# EAGLE design RN-131-Carrier-Board (EAGLE 5.11)
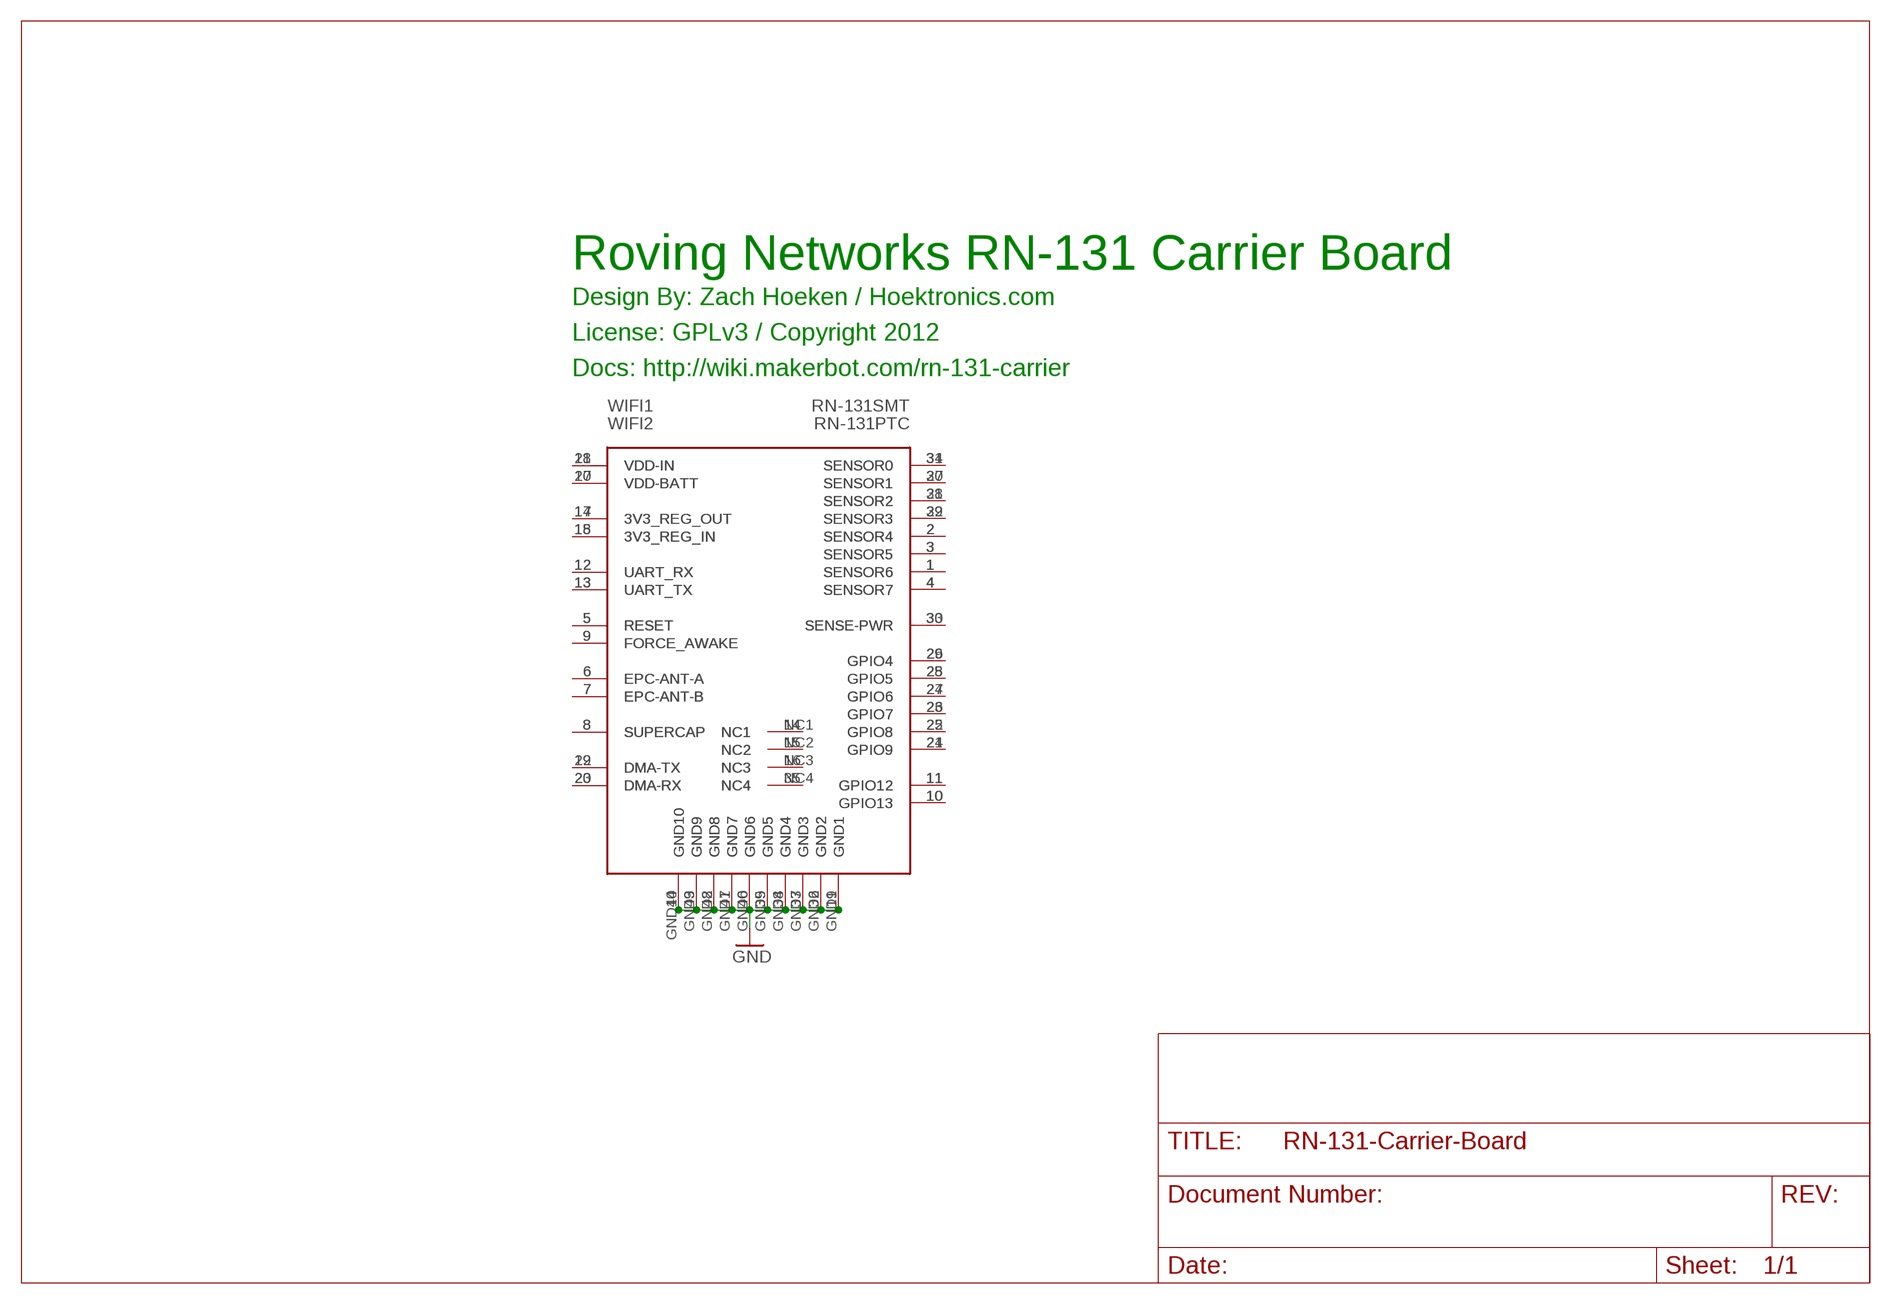
[diagram p0: schematic, sheet 1]

## Parts
WIFI1  RN-131PTC  [RN-131-CARRIER]
WIFI2  RN-131SMT  [RN-131]

## Nets
GND: WIFI1.GND1 WIFI1.GND2 WIFI1.GND3 WIFI1.GND4 WIFI1.GND5 WIFI1.GND6 WIFI1.GND7 WIFI1.GND8 WIFI1.GND9 WIFI1.GND10 WIFI2.19(GND1) WIFI2.36(GND2) WIFI2.37(GND3) WIFI2.38(GND4) WIFI2.39(GND5) WIFI2.40(GND6) WIFI2.41(GND7) WIFI2.42(GND8) WIFI2.43(GND9) WIFI2.44(GND10)
N$1: WIFI1.31(SENSOR0) WIFI2.34(SENSOR0)
N$2: WIFI1.27(SENSOR1) WIFI2.30(SENSOR1)
N$3: WIFI1.28(SENSOR2) WIFI2.31(SENSOR2)
N$4: WIFI1.29(SENSOR3) WIFI2.32(SENSOR3)
N$5: WIFI1.2(SENSOR4) WIFI2.2(SENSOR4)
N$6: WIFI1.3(SENSOR5) WIFI2.3(SENSOR5)
N$7: WIFI1.1(SENSOR6) WIFI2.1(SENSOR6)
N$8: WIFI1.4(SENSOR7) WIFI2.4(SENSOR7)
N$9: WIFI1.5(RESET) WIFI2.5(RESET)
N$10: WIFI1.6(EPC-ANT-A) WIFI2.6(EPC-ANT-A)
N$11: WIFI1.7(EPC-ANT-B) WIFI2.7(EPC-ANT-B)
N$12: WIFI1.8(SUPERCAP) WIFI2.8(SUPERCAP)
N$13: WIFI1.9(FORCE_AWAKE) WIFI2.9(FORCE_AWAKE)
N$14: WIFI1.10(GPIO13) WIFI2.10(GPIO13)
N$15: WIFI1.11(GPIO12) WIFI2.11(GPIO12)
N$16: WIFI1.12(UART_RX) WIFI2.12(UART_RX)
N$17: WIFI1.13(UART_TX) WIFI2.13(UART_TX)
N$18: WIFI1.NC1 WIFI2.14(NC1)
N$19: WIFI1.NC2 WIFI2.15(NC2)
N$20: WIFI1.NC3 WIFI2.16(NC3)
N$21: WIFI1.14(3V3_REG_OUT) WIFI2.17(3V3_REG_OUT)
N$22: WIFI1.15(3V3_REG_IN) WIFI2.18(3V3_REG_IN)
N$24: WIFI1.17(VDD-BATT) WIFI2.20(VDD-BATT)
N$25: WIFI1.18(VDD-IN) WIFI2.21(VDD-IN)
N$26: WIFI1.19(DMA-TX) WIFI2.22(DMA-TX)
N$27: WIFI1.20(DMA-RX) WIFI2.23(DMA-RX)
N$28: WIFI1.21(GPIO9) WIFI2.24(GPIO9)
N$29: WIFI1.22(GPIO8) WIFI2.25(GPIO8)
N$30: WIFI1.23(GPIO7) WIFI2.26(GPIO7)
N$31: WIFI1.24(GPIO6) WIFI2.27(GPIO6)
N$32: WIFI1.25(GPIO5) WIFI2.28(GPIO5)
N$33: WIFI1.26(GPIO4) WIFI2.29(GPIO4)
N$34: WIFI1.NC4 WIFI2.35(NC4)
N$44: WIFI1.30(SENSE-PWR) WIFI2.33(SENSE-PWR)

## Notes on the sheet
- Roving Networks RN-131 Carrier Board
- Design By: Zach Hoeken / Hoektronics.com
- License: GPLv3 / Copyright 2012
- Docs: http://wiki.makerbot.com/rn-131-carrier

## Library data of the parts
WIFI1 WIFI2 = Hoektronics:RN-131

## Board
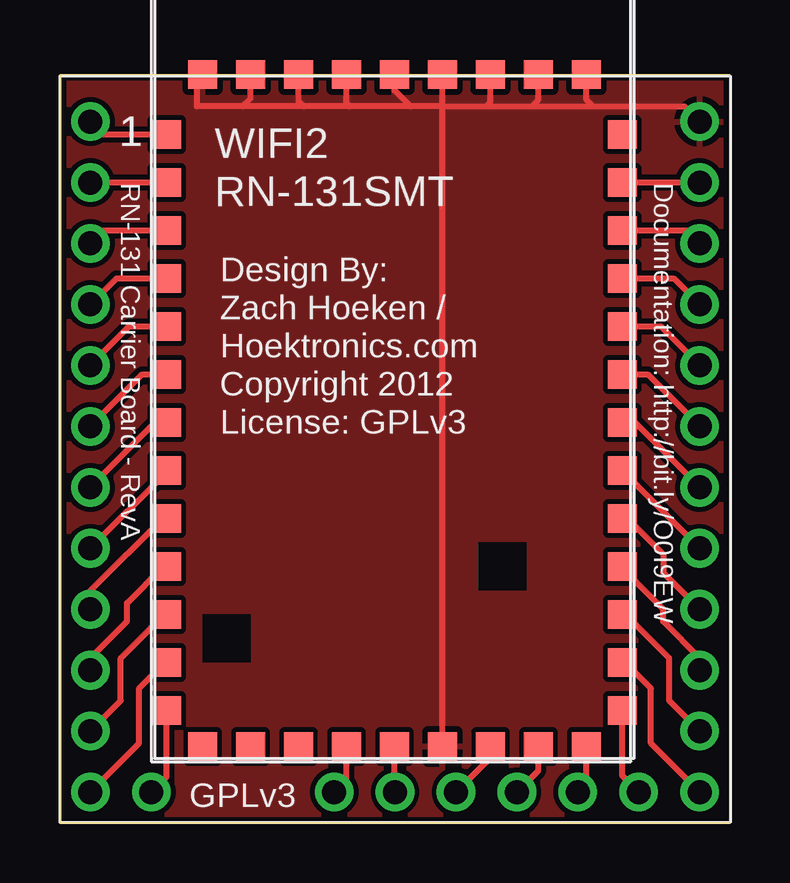
[diagram p1: board, top side]

Size 27.92 x 31.17 mm. Coordinates in mm from the lower left corner, seen from the top.
Outline: 0,0 27.92,0 27.92,31.17 0,31.17 0,0
Copper layers (1*16): Top 0.035mm / dielectric 1.5mm / Bottom 0.035mm
Design rules "hoektronics": minimum track width 8mil, minimum drill 20mil, track to track 8mil, track to pad 8mil, pad to pad 8mil, via to via 8mil, smd to smd 8mil, copper to edge 10mil, drill to drill 8mil, minimum pad ring 12mil, minimum via ring 10mil, stop-mask expansion 4mil, vias tented up to drill 25mil, thermal gap 10mil

### Footprints (pad centres in the part's own frame; a part is rotated, then mirrored left to right if it is on the bottom)
RN-131-CARRIER = drill 1 round: 1 -3.175,26.035; 2 -3.175,23.495; 3 -3.175,20.955; 4 -3.175,18.415; 5 -3.175,15.875; 6 -3.175,13.335; 7 -3.175,10.795; 8 -3.175,8.255; 9 -3.175,5.715; 10 -3.175,3.175; 11 -3.175,0.635; 12 -3.175,-1.905; 13 -0.635,-1.905; 14 6.985,-1.905; 15 9.525,-1.905; 17 12.065,-1.905; 18 14.605,-1.905; 19 17.145,-1.905; 20 19.685,-1.905; 21 22.225,-1.905; 22 22.225,0.635; 23 22.225,3.175; 24 22.225,5.715; 25 22.225,8.255; 26 22.225,10.795; 27 22.225,13.335; 28 22.225,15.875; 29 22.225,18.415; 30 22.225,20.955; 31 22.225,23.495; GND1 22.225,26.035 | smd 0.5 x 0.5: GND2 17.5,28; GND3 15.5,28; GND4 13.5,28; GND5 11.5,28; GND6 9.5,28; GND7 7.5,28; GND8 5.5,28; GND9 3.5,28; GND10 1.5,28; NC1 1.5,0; NC2 3.5,0; NC3 5.5,0; NC4 19,25.5
RN-131 = smd 1.2 x 1.2: 1 0,25.5; 2 0,23.5; 3 0,21.5; 4 0,19.5; 5 0,17.5; 6 0,15.5; 7 0,13.5; 8 0,11.5; 9 0,9.5; 10 0,7.5; 11 0,5.5; 12 0,3.5; 13 0,1.5; 14 1.5,0; 15 3.5,0; 16 5.5,0; 17 7.5,0; 18 9.5,0; 19 11.5,0; 20 13.5,0; 21 15.5,0; 22 17.5,0; 23 19,1.5; 24 19,3.5; 25 19,5.5; 26 19,7.5; 27 19,9.5; 28 19,11.5; 29 19,13.5; 30 19,15.5; 31 19,17.5; 32 19,19.5; 33 19,21.5; 34 19,23.5; 35 19,25.5; 36 17.5,28; 37 15.5,28; 38 13.5,28; 39 11.5,28; 40 9.5,28; 41 7.5,28; 42 5.5,28; 43 3.5,28; 44 1.5,28

### Placement (x,y rotation side)
WIFI1  4.45,3.17 0 top
WIFI2  4.45,3.17 0 top

### Tracks (layer width: path | path; a pad name or v marks a point on that pad's centre or on a via)
GND
  Top 0.254: WIFI1.GND1 26.04,29.84 22.23,29.84 | 7.62,29.84 5.71,29.84 5.71,30.95 WIFI2.44 | 10.16,29.84 7.62,29.84 | 12.06,29.84 10.16,29.84 | 14.61,29.84 12.06,29.84 | 15.88,29.84 14.61,29.84 | 15.88,29.84 17.78,29.84 | 17.78,29.84 19.68,29.84 | 19.68,29.84 22.23,29.84 | WIFI2.43 7.95,30.17 7.62,29.84 | WIFI2.42 9.95,30.06 10.16,29.84 | WIFI2.41 11.95,29.96 12.06,29.84 | WIFI2.40 13.95,30.5 14.61,29.84 | WIFI2.39 15.95,29.91 15.88,29.84 | WIFI2.38 17.95,30.01 17.78,29.84 | WIFI2.37 19.95,30.11 19.68,29.84 | WIFI2.36 21.95,30.12 22.23,29.84 | WIFI2.19 15.95,29.77 15.88,29.84
  pour Top: -1.27,33.02 29.21,33.02 29.21,-1.27 -1.27,-1.27
N$1
  Top 0.254: WIFI2.34 WIFI1.31
N$2
  Top 0.254: WIFI2.30 24.5,18.68 WIFI1.27
N$3
  Top 0.254: WIFI2.31 25.05,20.68 WIFI1.28
N$4
  Top 0.254: WIFI2.32 25.59,22.68 WIFI1.29
N$5
  Top 0.254: WIFI2.2 WIFI1.2
N$6
  Top 0.254: WIFI2.3 1.81,24.68 WIFI1.3
N$7
  Top 0.254: WIFI2.1 1.8,28.68 WIFI1.1
N$8
  Top 0.254: WIFI2.4 2.35,22.68 WIFI1.4
N$9
  Top 0.254: WIFI2.5 2.9,20.68 WIFI1.5
N$10
  Top 0.254: WIFI2.6 3.44,18.68 WIFI1.6
N$11
  Top 0.254: WIFI2.7 3.98,16.68 WIFI1.7
N$12
  Top 0.254: WIFI2.8 4.45,14.61 WIFI1.8
N$13
  Top 0.254: WIFI2.9 4.29,12.68 1.27,9.65 WIFI1.9
N$14
  Top 0.254: WIFI2.10 4.33,10.68 2.79,9.14 2.79,8.38 1.27,6.86 WIFI1.10
N$15
  Top 0.254: WIFI2.11 4.36,8.68 2.54,6.86 2.54,5.08 WIFI1.11
N$16
  Top 0.254: WIFI2.12 4.39,6.67 3.3,5.59 3.3,3.3 WIFI1.12
N$17
  Top 0.254: WIFI2.13 4.45,1.91 WIFI1.13
N$21
  Top 0.254: WIFI2.17 11.95,1.78 WIFI1.14
N$22
  Top 0.254: WIFI2.18 13.95,1.29 WIFI1.15
N$24
  Top 0.254: WIFI2.20 17.95,2.71 WIFI1.17
N$25
  Top 0.254: WIFI2.21 19.95,2.17 WIFI1.18
N$26
  Top 0.254: WIFI2.22 21.95,1.62 WIFI1.19
N$27
  Top 0.254: WIFI2.23 23.45,1.96 WIFI1.20
N$28
  Top 0.254: WIFI2.24 23.55,6.67 24.64,5.59 24.64,3.3 WIFI1.21
N$29
  Top 0.254: WIFI2.25 23.58,8.68 25.4,6.86 25.4,5.08 WIFI1.22
N$30
  Top 0.254: WIFI2.26 23.45,10.59 25.15,8.89 25.15,8.38 26.67,6.86 WIFI1.23
N$31
  Top 0.254: WIFI2.27 23.65,12.68 25.15,11.18 25.15,10.41 WIFI1.24
N$32
  Top 0.254: WIFI2.28 23.45,14.65 WIFI1.25
N$33
  Top 0.254: WIFI2.29 23.96,16.68 WIFI1.26
N$44
  Top 0.254: WIFI2.33 26.12,24.68 WIFI1.30

### Text on the board
tPlace: RN-131 Carrier Board - RevA | Documentation: http://bit.ly/O0I9EW | Design By: | Zach Hoeken / | Hoektronics.com | Copyright 2012 | License: GPLv3 | GPLv3